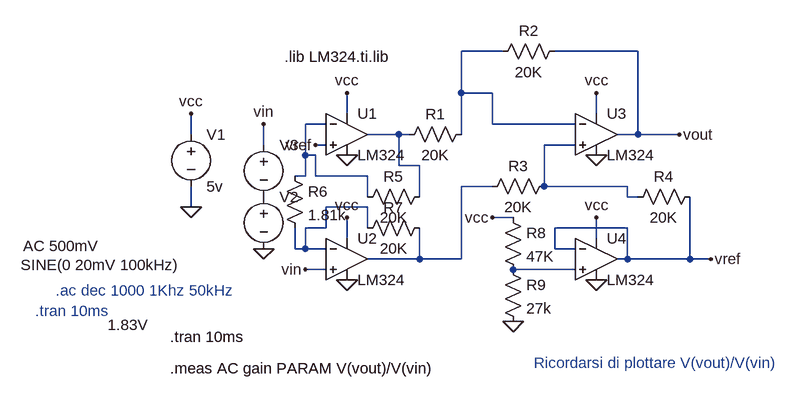
[diagram p0: schematic LM324.asc]
LM324.asc, the LTspice schematic file:
Version 4
SHEET 1 1188 680
WIRE 272 -32 208 -32
WIRE 480 -32 352 -32
WIRE 208 32 208 -32
WIRE 256 32 208 32
WIRE 32 64 32 32
WIRE 416 64 416 32
WIRE 0 80 -32 80
WIRE 256 80 256 32
WIRE 384 80 256 80
WIRE -208 96 -208 64
WIRE 112 96 64 96
WIRE 128 96 112 96
WIRE 208 96 208 32
WIRE 480 96 480 -32
WIRE 480 96 448 96
WIRE 544 96 480 96
WIRE -96 112 -96 80
WIRE 0 112 -16 112
WIRE 384 112 336 112
WIRE -32 128 -32 80
WIRE -16 128 -32 128
WIRE 112 144 112 96
WIRE 144 144 112 144
WIRE -32 160 -32 128
WIRE -32 160 -48 160
WIRE -16 160 -16 128
WIRE 64 160 -16 160
WIRE 256 176 208 176
WIRE 336 176 336 112
WIRE 464 176 336 176
WIRE 64 192 64 160
WIRE 144 192 144 144
WIRE 464 192 464 176
WIRE 480 192 464 192
WIRE -208 208 -208 176
WIRE 64 208 0 208
WIRE 288 224 256 224
WIRE 0 240 0 208
WIRE 0 240 -32 240
WIRE 64 240 64 208
WIRE 464 240 352 240
WIRE 32 256 32 224
WIRE 416 256 416 224
WIRE -48 272 -48 240
WIRE -32 272 -32 240
WIRE -32 272 -48 272
WIRE 0 272 -32 272
WIRE 352 272 352 240
WIRE 384 272 352 272
WIRE 144 288 144 240
WIRE 144 288 64 288
WIRE 208 288 208 176
WIRE 208 288 144 288
WIRE 464 288 464 240
WIRE 464 288 448 288
WIRE 560 288 560 192
WIRE 560 288 464 288
WIRE 592 288 560 288
WIRE 0 304 -32 304
WIRE 384 304 288 304
FLAG -208 208 0
FLAG -208 64 vcc
FLAG 32 32 vcc
FLAG 416 32 vcc
FLAG 416 224 vcc
FLAG 32 224 vcc
FLAG 32 128 0
FLAG 416 128 0
FLAG 416 320 0
FLAG 32 320 0
FLAG 288 384 0
FLAG 256 224 vcc
FLAG 592 288 vref
FLAG -96 272 0
FLAG 544 96 vout
FLAG -96 80 vin
FLAG -32 304 vin
FLAG -16 112 vref
SYMBOL Opamps\\opamp2 32 32 R0
SYMATTR InstName U1
SYMATTR Value LM324
SYMBOL Opamps\\opamp2 32 224 R0
SYMATTR InstName U2
SYMATTR Value LM324
SYMBOL Opamps\\opamp2 416 32 R0
SYMATTR InstName U3
SYMATTR Value LM324
SYMBOL Opamps\\opamp2 416 224 R0
SYMATTR InstName U4
SYMATTR Value LM324
SYMBOL voltage -208 80 R0
WINDOW 123 0 0 Left 0
WINDOW 39 0 0 Left 0
SYMATTR InstName V1
SYMATTR Value 5v
SYMBOL res 224 80 R90
WINDOW 0 0 56 VBottom 2
WINDOW 3 32 56 VTop 2
SYMATTR InstName R1
SYMATTR Value 20K
SYMBOL res 368 -48 R90
WINDOW 0 0 56 VBottom 2
WINDOW 3 32 56 VTop 2
SYMATTR InstName R2
SYMATTR Value 20K
SYMBOL res 352 160 R90
WINDOW 0 0 56 VBottom 2
WINDOW 3 32 56 VTop 2
SYMATTR InstName R3
SYMATTR Value 20K
SYMBOL res 48 208 R270
WINDOW 0 32 56 VTop 2
WINDOW 3 0 56 VBottom 2
SYMATTR InstName R5
SYMATTR Value 20K
SYMBOL res -64 144 R0
SYMATTR InstName R6
SYMATTR Value 1.81k
SYMBOL res 160 224 R90
WINDOW 0 0 56 VBottom 2
WINDOW 3 32 56 VTop 2
SYMATTR InstName R7
SYMATTR Value 20K
SYMBOL res 576 176 R90
WINDOW 0 0 56 VBottom 2
WINDOW 3 32 56 VTop 2
SYMATTR InstName R4
SYMATTR Value 20K
SYMBOL voltage -96 96 R0
WINDOW 3 -374 201 Left 2
WINDOW 123 -370 172 Left 2
WINDOW 39 0 0 Left 0
SYMATTR Value SINE(0 20mV 100kHz)
SYMATTR Value2 AC 500mV
SYMATTR InstName V3
SYMBOL res 272 208 R0
SYMATTR InstName R8
SYMATTR Value 47K
SYMBOL res 272 288 R0
SYMATTR InstName R9
SYMATTR Value 27k
SYMBOL voltage -96 176 R0
WINDOW 3 -240 213 Left 2
WINDOW 123 -240 185 Left 2
WINDOW 39 0 0 Left 0
SYMATTR Value 1.83V
SYMATTR InstName V2
TEXT -64 -24 Left 2 !.lib LM324.ti.lib
TEXT -240 408 Left 2 !.tran 10ms
TEXT -240 456 Left 2 !.meas AC gain PARAM V(vout)/V(vin)
TEXT 320 448 Left 2 ;Ricordarsi di plottare V(vout)/V(vin)
TEXT -416 336 Left 2 ;.ac dec 1000 1Khz 50kHz
TEXT -448 368 Left 2 ;.tran 10ms

The netlist it stands for:
* LM324.asc
XU1 vref N002 vcc 0 N003 LM324  ; pins In+ In- V+ V- OUT
XU2 vin N006 vcc 0 N005 LM324  ; pins In+ In- V+ V- OUT
XU3 N004 N001 vcc 0 vout LM324  ; pins In+ In- V+ V- OUT
XU4 N007 vref vcc 0 vref LM324  ; pins In+ In- V+ V- OUT
V1 vcc 0 5v
R1 N001 N003 20K
R2 vout N001 20K
R3 N004 N005 20K
R5 N002 N003 20K
R6 N002 N006 1.81k
R7 N005 N006 20K
R4 vref N004 20K
V3 vin P001 SINE(0 20mV 100kHz) AC 500mV
R8 vcc N007 47K
R9 N007 0 27k
V2 P001 0 1.83V
.lib LM324.ti.lib
.tran 10ms
.meas AC gain PARAM V(vout)/V(vin)
* Ricordarsi di plottare V(vout)/V(vin)
* .ac dec 1000 1Khz 50kHz
* .tran 10ms
.backanno
.end